# Altium project Fast_Servo.PrjPCB (part 3 of 7)

## Sheet DAC_AFE.SchDoc: DAC AFE
size 420 x 297 mm; Author: P. Zdunek; DrawnBy: P. Zdunek; Organization: WUT ISE; Address1: L3, 12a Rodborough Rd; Address2: Frenchs Forest; Address3: NSW; Address4: Australia 2086; DocumentNumber: 7; SheetNumber: 7; SheetTotal: 37; ModifiedBy: -; CheckedDate: -; Title2: Fast Stabilizer; DivGrp: WUT ISE; Designer: G.Kasprowicz
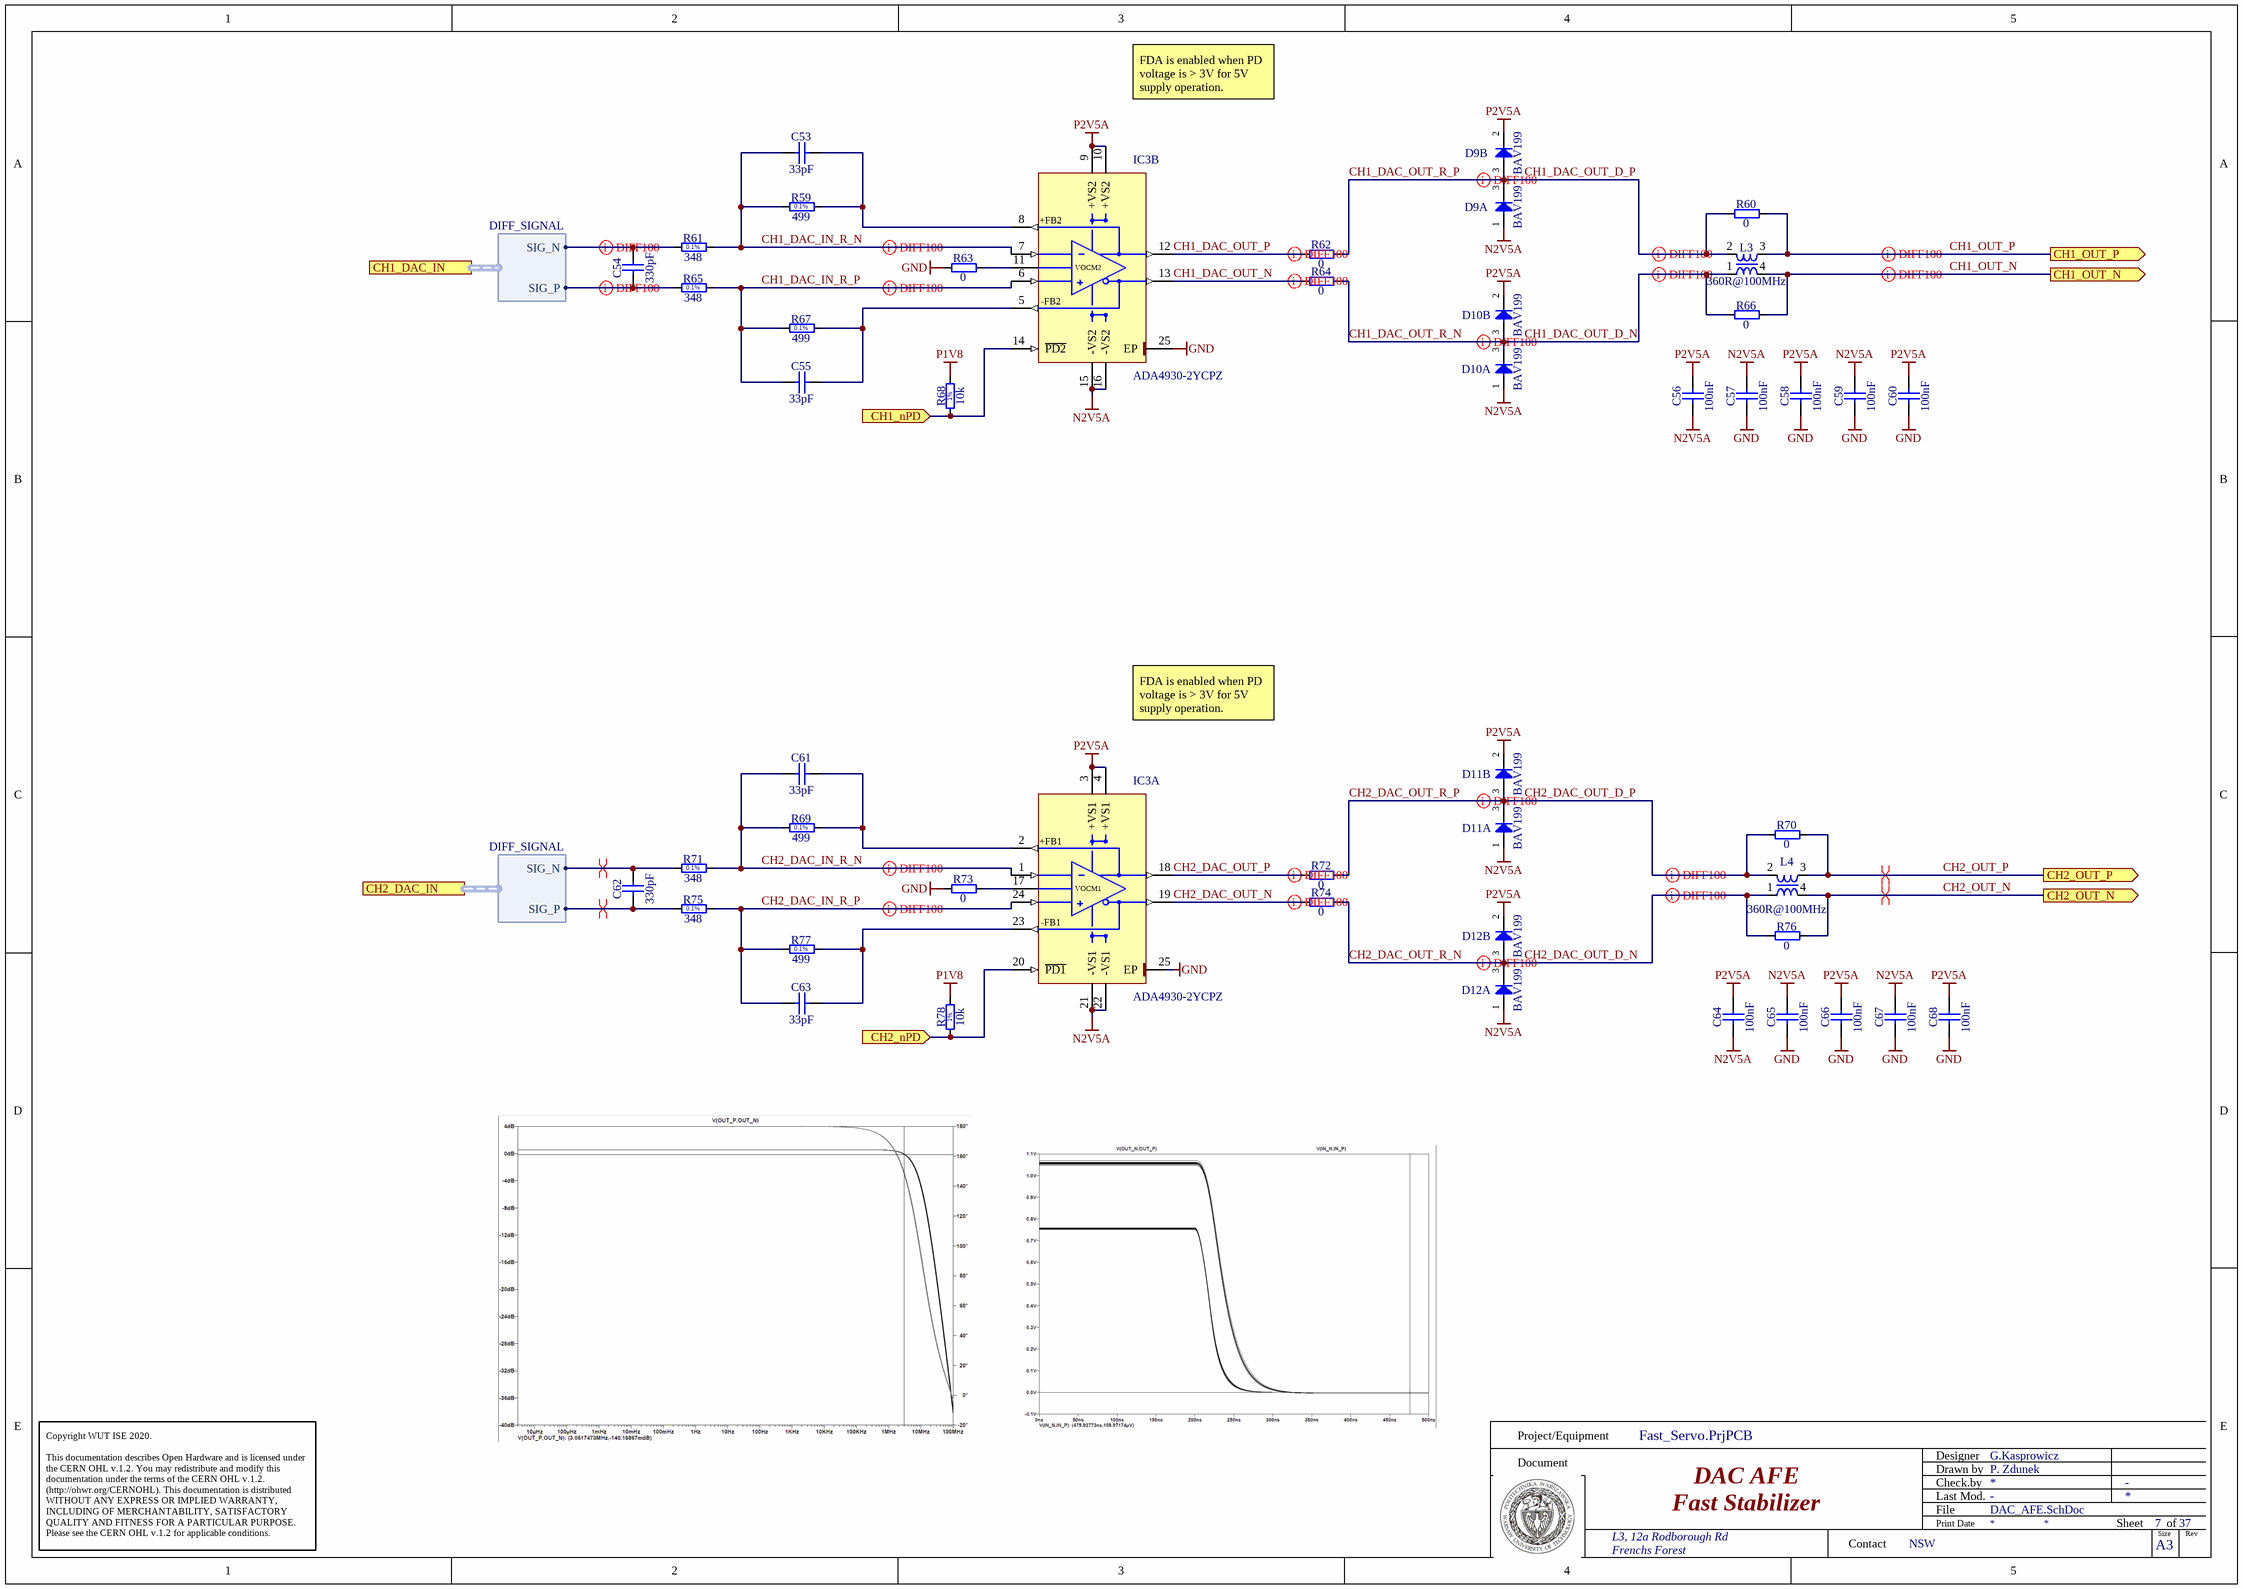
[diagram p8: DAC_AFE.SchDoc]

### Parts
C53  33pF  [CAPC1608X87N]
C54  330pF  [CAPC1608X87N]
C55  33pF  [CAPC1608X87N]
C56  100nF  [CAPC1005X55N]
C57  100nF  [CAPC1005X55N]
C58  100nF  [CAPC1005X55N]
C59  100nF  [CAPC1005X55N]
C60  100nF  [CAPC1005X55N]
C61  33pF  [CAPC1608X87N]
C62  330pF  [CAPC1608X87N]
C63  33pF  [CAPC1608X87N]
C64  100nF  [CAPC1005X55N]
C65  100nF  [CAPC1005X55N]
C66  100nF  [CAPC1005X55N]
C67  100nF  [CAPC1005X55N]
C68  100nF  [CAPC1005X55N]
D9  BAV199  [SOT95P240X110-3N]  (parts A,B of 2)
D10  BAV199  [SOT95P240X110-3N]  (parts A,B of 2)
D11  BAV199  [SOT95P240X110-3N]  (parts A,B of 2)
D12  BAV199  [SOT95P240X110-3N]  (parts A,B of 2)
IC3  ADA4930-2YCPZ  [QFN50P400X400X80-25N-S240]  (parts A,B of 2)
L3  360R@100MHz  [IND_TDK_ACM2012]
L4  360R@100MHz  [IND_TDK_ACM2012]
R59  499  [RESC1608X55N]
R60  0  [RESC1005X40N]
R61  348  [RESC1608X55N]
R62  0  [RESC1005X40N]
R63  0  [RESC1005X40N]
R64  0  [RESC1005X40N]
R65  348  [RESC1608X55N]
R66  0  [RESC1005X40N]
R67  499  [RESC1608X55N]
R68  10k  [RESC1005X40N]
R69  499  [RESC1608X55N]
R70  0  [RESC1005X40N]
R71  348  [RESC1608X55N]
R72  0  [RESC1005X40N]
R73  0  [RESC1005X40N]
R74  0  [RESC1005X40N]
R75  348  [RESC1608X55N]
R76  0  [RESC1005X40N]
R77  499  [RESC1608X55N]
R78  10k  [RESC1005X40N]

### Ports
CH1_DAC_IN (harness DIFF_SIGNAL), CH1_nPD (in), CH1_OUT_N (out), CH1_OUT_P (out), CH2_DAC_IN (harness DIFF_SIGNAL), CH2_nPD (in), CH2_OUT_N (out), CH2_OUT_P (out)

### Harnesses
DIFF_SIGNAL: SIG_N, SIG_P

### Nets
GND: C57.1 C58.1 C59.1 C60.1 C65.1 C66.1 C67.1 C68.1 IC3.25(EP) R63.1 R73.1
N2V5A: C56.1 C57.2 C59.2 C64.1 C65.2 C67.2 D9.1(A) D10.1(A) D11.1(A) D12.1(A) IC3.15(-VS2) IC3.16(-VS2) IC3.21(-VS1) IC3.22(-VS1)
P1V8: R68.2 R78.2
P2V5A: C56.2 C58.2 C60.2 C64.2 C66.2 C68.2 D9.2(C) D10.2(C) D11.2(C) D12.2(C) IC3.3(+VS1) IC3.4(+VS1) IC3.9(+VS2) IC3.10(+VS2)
CH1_DAC_IN_R_N: C53.1 IC3.7(-IN2) R59.1 R61.2
CH1_DAC_IN_R_P: C55.1 IC3.6(+IN2) R65.2 R67.1
CH1_DAC_OUT_D_N: D10.3(COMAC) L3.1 R64.2 R66.1  [also labelled CH1_DAC_OUT_R_N]
CH1_DAC_OUT_D_P: D9.3(COMAC) L3.2 R60.1 R62.2  [also labelled CH1_DAC_OUT_R_P]
CH1_DAC_OUT_N: IC3.13(-OUT2) R64.1
CH1_DAC_OUT_P: IC3.12(+OUT2) R62.1
CH1_OUT_N: L3.4 R66.2 ; port CH1_OUT_N  [project net DAC_0_N]
CH1_OUT_P: L3.3 R60.2 ; port CH1_OUT_P  [project net DAC_0_P]
CH2_DAC_IN_R_N: C61.1 IC3.1(-IN1) R69.1 R71.2
CH2_DAC_IN_R_P: C63.1 IC3.24(+IN1) R75.2 R77.1
CH2_DAC_OUT_D_N: D12.3(COMAC) L4.1 R74.2 R76.1  [also labelled CH2_DAC_OUT_R_N]
CH2_DAC_OUT_D_P: D11.3(COMAC) L4.2 R70.1 R72.2  [also labelled CH2_DAC_OUT_R_P]
CH2_DAC_OUT_N: IC3.19(-OUT1) R74.1
CH2_DAC_OUT_P: IC3.18(+OUT1) R72.1
CH2_OUT_N: L4.4 R76.2 ; port CH2_OUT_N  [project net DAC_1_N]
CH2_OUT_P: L4.3 R70.2 ; port CH2_OUT_P  [project net DAC_1_P]
DAC_AFE_CH1_nPD: IC3.14(~{PD2}) R68.1 ; port CH1_nPD
DAC_AFE_CH2_nPD: IC3.20(~{PD1}) R78.1 ; port CH2_nPD
IOUT_N: C62.2 R71.1 ; port CH2_DAC_IN.SIG_N
IOUT_P: C62.1 R75.1 ; port CH2_DAC_IN.SIG_P
QOUT_N: C54.2 R61.1 ; port CH1_DAC_IN.SIG_N
QOUT_P: C54.1 R65.1 ; port CH1_DAC_IN.SIG_P
NetC53_2: C53.2 IC3.8(+FB2) R59.2
NetC55_2: C55.2 IC3.5(-FB2) R67.2
NetC61_2: C61.2 IC3.2(+FB1) R69.2
NetC63_2: C63.2 IC3.23(-FB1) R77.2
NetIC3_11: IC3.11(VOCM2) R63.2
NetIC3_17: IC3.17(VOCM1) R73.2

### Layout directives
differential pair: CH1_DAC_IN_R_N, CH1_DAC_IN_R_P, CH1_DAC_OUT_D_N, CH1_DAC_OUT_D_P, CH1_DAC_OUT_N, CH1_DAC_OUT_P, CH2_DAC_IN_R_N, CH2_DAC_IN_R_P, CH2_DAC_OUT_D_N, CH2_DAC_OUT_D_P, CH2_DAC_OUT_N, CH2_DAC_OUT_P, DAC_0_N, DAC_0_P, DAC_1_N, DAC_1_P, IOUT_N, IOUT_P, QOUT_N, QOUT_P

### Notes on the sheet
- FDA is enabled when PD voltage is > 3V for 5V supply operation.
- Project/Equipment
- Document
- Designer
- Drawn by
- Check.by
- Copyright WUT ISE 2020.
  This documentation describes Open Hardware and is licensed under the CERN OHL v.1.2. You may redistribute and modify this documentation under the terms of the CERN OHL v.1.2. (http://ohwr.org/CERNOHL). This documentation is distributed WITHOUT ANY EXPRESS OR IMPLIED WARRANTY, INCLUDING OF MERCHANTABILITY, SATISFACTORY QUALITY AND FITNESS FOR A PARTICULAR PURPOSE. Please see the CERN OHL v.1.2 for applicable conditions.
- Contact
- File
- Last Mod.
- Print Date
- Sheet
- Size
- A3
- of
- Rev
- (in symbol R0402_10K_1%_0.0625W_100PPM) 1%
- (in symbol R0603_348R_0.1%_0.063W_10PPM) 0.1%
- (in symbol R0603_499R_0.1%_0.063W_10PPM) 0.1%

### Library data of the parts
C53 C55 C61 C63 = CC0603_33PF_50V_5%_NP0: Non-polarised capacitor; Part Description: SMD Multilayer Chip Ceramic Capacitor; Manufacturer: GENERIC; Manufacturer1 Part Number: 223886715339; Voltage: 50V; TC: C0G/NP0; Tolerance: ±5%; Part Number: CC0603_33PF_50V_5%_NP0; Component Kind: Standard; Component Type: Standard; Pin Count: 2; Value: 33pF; Status: Preferred; Manufacturer Part Number: CC0603_33PF_50V_5%_NP0; Case: 0603; Mounted: Yes; Socket: No; SMD: Yes; Sense: No; Manufacturer1 Example: PHYCOMP; Manufacturer1 ComponentHeight: 0.87mm; HelpURL: \\cern.ch\dfs\Applications\Altium\Datasheets\CC0603_NP0_PHYCOMP.pdf; Author: CERN DEM JLC; CreateDate: 03-Dec-07; LatestRevisionDate: 03-Dec-07
C54 C62 = CC0603_330PF_50V_1%_NP0: Non-polarised capacitor; Part Description: SMD Multilayer Chip Ceramic Capacitor; Manufacturer: GENERIC; Manufacturer1 Part Number: 223886718331; Voltage: 50V; TC: C0G/NP0; Tolerance: ±1%; Part Number: CC0603_330PF_50V_1%_NP0; Component Kind: Standard; Component Type: Standard; Pin Count: 2; Value: 330pF; Status: None; Manufacturer Part Number: CC0603_330PF_50V_1%_NP0; Case: 0603; Mounted: Yes; Socket: No; SMD: Yes; Sense: No; Manufacturer1 Example: PHYCOMP; Manufacturer1 ComponentHeight: 0.87mm; HelpURL: \\cern.ch\dfs\Applications\Altium\Datasheets\CC0603_NP0_PHYCOMP.pdf; Author: CERN DEM MR; CreateDate: 06.09.2017; LatestRevisionDate: 06.09.2017
C56-C60 C64-C68 = CC0402_100NF_16V_10%_X7R: Non-polarised capacitor; Part Description: SMD Multilayer Chip Ceramic Capacitor; Manufacturer: GENERIC; Manufacturer1 Part Number: GRM155R71C104KA88D; Voltage: 16V; TC: X7R; Tolerance: ±10%; Part Number: CC0402_100NF_16V_10%_X7R; Component Kind: Standard; Component Type: Standard; Pin Count: 2; Value: 100nF; Status: Not Recommended; Manufacturer Part Number: CC0402_100NF_16V_10%_X7R; Case: 0402; Mounted: Yes; Socket: No; SMD: Yes; Sense: No; Manufacturer1 Example: MURATA; Manufacturer1 ComponentHeight: 0.55mm; HelpURL: \\cern.ch\dfs\Applications\Altium\Datasheets\CC0402_X7R_MURATA_GRM.pdf; Author: CERN DEM JLC; CreateDate: 05-Dec-13; LatestRevisionDate: 03-Dec-07
D9-D12 = BAV199: Serial Diode; Part Description: Low-Leakage Double Diode; Manufacturer: NXP SEMICONDUCTORS; Voltage: 75V; Power: 250mW; PressFit: No; Bonding: No; Part Number: BAV199; Component Kind: Standard; Component Type: Standard; Device: BAV199; PackageDescription: SOT23 3-Leads, Pitch 0.95mm - Body 1.4x3mm, IPC Medium Density; Manufacturer Part Number: BAV199; Pin Count: 3; Case: SOT23-3; Mounted: Yes; Socket: No; SMD: Yes; Sense: No; ComponentHeight: 1.1mm; HelpURL: \\cern.ch\dfs\Applications\Altium\Datasheets\BAV199.pdf; Author: CERN DEM JMW; CreateDate: 2008-11-21; LatestRevisionDate: 2008-11-21
IC3 = ADA4930-2YCPZ: Ultralow Noise Drivers For Low Voltage ADCs; Manufacturer: ANALOG DEVICES; PressFit: No; Bonding: No; Part Number: ADA4930-2YCPZ; Component Kind: Standard; Component Type: Standard; Device: ADA4930-2YCPZ; PackageDescription: QFN, 0.50mm Pitch, Square; 24 Pin, 4.00mm L X 4.00mm W X 0.80mm H body (w/Thermal Tab 2.40 X 2.40mm), IPC Medium Density; Part Description: Ultralow Noise Drivers For Low Voltage ADCs; Manufacturer Part Number: ADA4930-2YCPZ; Pin Count: 25; Case: QFN24; Mounted: Yes; Socket: No; SMD: Yes; Sense: No; ComponentHeight: 0.8mm; Author: CERN DEM MR; HelpURL: \\cern.ch\dfs\Applications\Altium\Datasheets\ADA4930-2YCPZ.pdf; CreateDate: 23/11/2016; LatestRevisionDate: 23/11/2016
L3 L4 = IND_TDK_ACM2012-361-2P: Inductor Common Mode; Part Description: Common Mode Filters For High-Speed Differential Signal Line, TDK ACM2012 Series; Manufacturer: TDK; Power: 220mA; Resistance: 0R5; Part Number: IND_TDK_ACM2012-361-2P; Component Kind: Standard; Component Type: Standard; Pin Count: 2; Value: 360R@100MHz; Status: None; Manufacturer Part Number: ACM2012-361-2P; Mounted: Yes; Socket: No; SMD: Yes; Sense: No; ComponentHeight: 1.3mm; HelpURL: \\cern.ch\dfs\Applications\Altium\Datasheets\IND_TDK_ACM2012.pdf; Author: CERN DEM BC; CreateDate: 07/07/2020; LatestRevisionDate: 07/07/2020
R59 R67 R69 R77 = R0603_499R_0.1%_0.063W_10PPM: Resistor - 0.1%; Part Description: Thin Film Chip Resistor; Manufacturer: GENERIC; Manufacturer1 Part Number: RN73C1J499RBTDF; Power: 0.063W; TC: ±10ppm; PressFit: No; Part Number: R0603_499R_0.1%_0.063W_10PPM; Component Kind: Standard; Component Type: Standard; Pin Count: 2; Value: 499; Status: Not Recommended; Tolerance: ±0.1%; Manufacturer Part Number: R0603_499R_0.1%_0.063W_10PPM; Case: 0603; Mounted: Yes; Sense: No; Socket: No; SMD: Yes; Manufacturer1 Example: TYCO HOLSWORTHY; Manufacturer1 ComponentHeight: 0.5mm; HelpURL: \\cern.ch\dfs\Applications\Altium\Datasheets\R0603_Tyco_RN73.pdf; Author: CERN DEM JLC; CreateDate: 03-Dec-07; LatestRevisionDate: 13-Mar-08
R60 R62-R64 R66 R70 R72-R74 R76 = R0402_0R_JUMPER: Resistor; Part Description: 1A (0.05R Max DC Resistance) Zero Ohm Jumper; Manufacturer: GENERIC; Manufacturer1 Part Number: 232270591001L; PressFit: No; Part Number: R0402_0R_JUMPER; Component Kind: Standard; Component Type: Standard; Pin Count: 2; Value: 0; Status: Not Recommended; Manufacturer Part Number: R0402_0R_JUMPER; Case: 0402; Mounted: Yes; Sense: No; Socket: No; SMD: Yes; Manufacturer1 Example: YAGEO PHYCOMP; Manufacturer1 ComponentHeight: 0.4mm; HelpURL: \\cern.ch\dfs\Applications\Altium\Datasheets\R0402_Phycomp_RC0402.pdf; Author: CERN DEM JLC
  R60 R66 R70 R76: CreateDate: 03/12/2007; LatestRevisionDate: 17/10/2012
  R62-R64 R72-R74: CreateDate: 03-Dec-07; LatestRevisionDate: 17-Oct-12
R61 R65 R71 R75 = R0603_348R_0.1%_0.063W_10PPM: Resistor - 0.1%; Part Description: Thin Film Chip Resistor; Manufacturer: GENERIC; Manufacturer1 Part Number: RN73C1J348RBTDF; Power: 0.063W; TC: ±10ppm; PressFit: No; Part Number: R0603_348R_0.1%_0.063W_10PPM; Component Kind: Standard; Component Type: Standard; Pin Count: 2; Value: 348; Status: Not Recommended; Tolerance: ±0.1%; Manufacturer Part Number: R0603_348R_0.1%_0.063W_10PPM; Case: 0603; Mounted: Yes; Sense: No; Socket: No; SMD: Yes; Manufacturer1 Example: TYCO HOLSWORTHY; Manufacturer1 ComponentHeight: 0.5mm; HelpURL: \\cern.ch\dfs\Applications\Altium\Datasheets\R0603_Tyco_RN73.pdf; Author: CERN DEM JLC; CreateDate: 03-Dec-07; LatestRevisionDate: 13-Mar-08
R68 R78 = R0402_10K_1%_0.0625W_100PPM: Resistor - 1%; Part Description: General Purpose Thick Film Chip Resistor; Manufacturer: GENERIC; Manufacturer1 Part Number: 232270671003L; PressFit: No; TC: ±100ppm/°C; Part Number: R0402_10K_1%_0.0625W_100PPM; Component Kind: Standard; Component Type: Standard; Pin Count: 2; Value: 10k; Status: Not Recommended; Manufacturer Part Number: R0402_10K_1%_0.0625W_100PPM; Case: 0402; Mounted: Yes; Sense: No; Socket: No; SMD: Yes; Manufacturer1 Example: YAGEO PHYCOMP; Manufacturer1 ComponentHeight: 0.4mm; HelpURL: \\cern.ch\dfs\Applications\Altium\Datasheets\R0402_Phycomp_RC0402.pdf; Author: CERN DEM JLC; CreateDate: 03-Dec-07; LatestRevisionDate: 17-Oct-12; Power: 0.0625W; Tolerance: ±1%

## Sheet DAC.SchDoc: DAC
size 420 x 297 mm; Author: P. Zdunek; DrawnBy: P. Zdunek; Organization: WUT ISE; Address1: PW ISE; Address2: Nowowiejska 15/19 00-665 Warsaw; Address3: p.zdunek90@gmail.com; DocumentNumber: 6; Revision: 1.0; SheetNumber: 6; SheetTotal: 37; ModifiedBy: -; CheckedDate: -; DivGrp: WUT ISE; Designer: P. Zdunek; Title2: Fast Stabilizer; ModifiedDate: -; ProjectName: Sensor Box
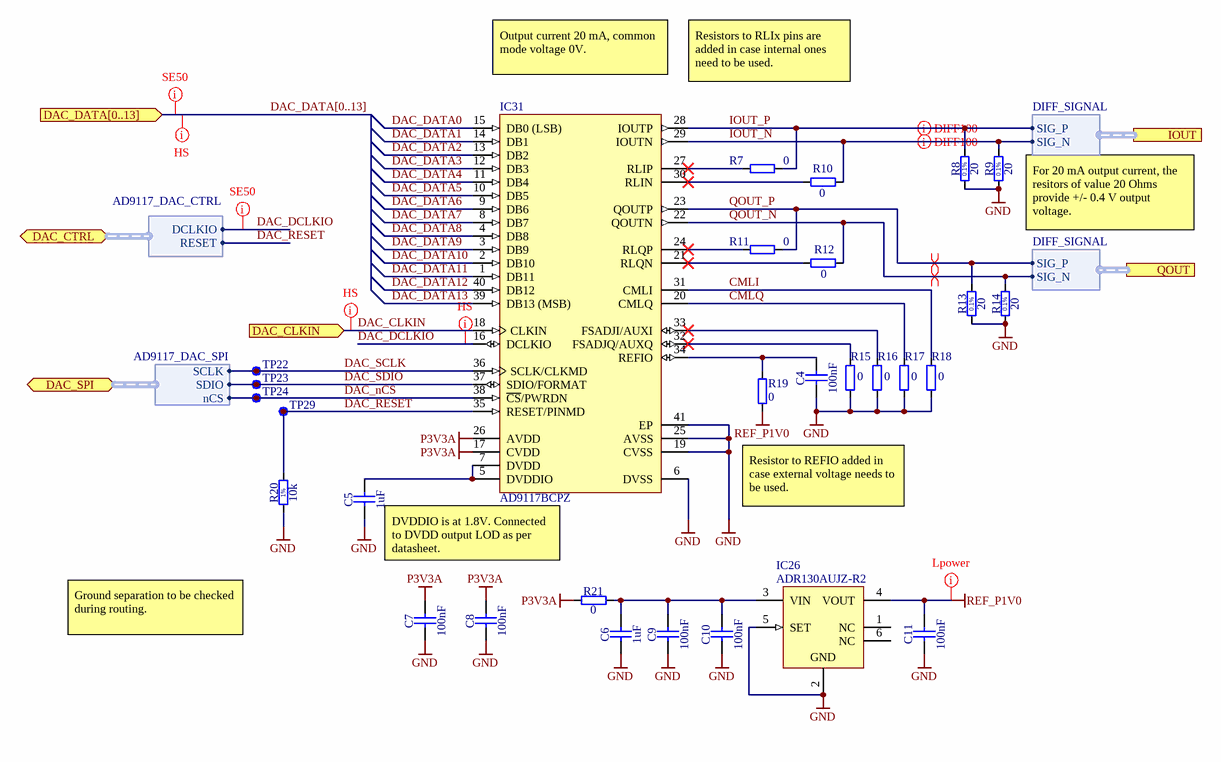
[diagram p9: DAC.SchDoc]

### Parts
C4  100nF  [CAPC1005X55N]
C5  1uF  [CAPC1005X55N]
C6  1uF  [CAPC1005X55N]
C7  100nF  [CAPC1005X55N]
C8  100nF  [CAPC1005X55N]
C9  100nF  [CAPC1005X55N]
C10  100nF  [CAPC1005X55N]
C11  100nF  [CAPC1005X55N]
IC26  ADR130AUJZ-R2  [ADI-UJ-6_N]
IC31  AD9117BCPZ  [CP-40-1_N]
R7  0  [RESC1005X40N]
R8  20  [RESC1608X55N]
R9  20  [RESC1608X55N]
R10  0  [RESC1005X40N]
R11  0  [RESC1005X40N]
R12  0  [RESC1005X40N]
R13  20  [RESC1608X55N]
R14  20  [RESC1608X55N]
R15  0  [RESC1005X40N]
R16  0  [RESC1005X40N]
R17  0  [RESC1005X40N]
R18  0  [RESC1005X40N]
R19  0  [RESC1005X40N]
R20  10k  [RESC1005X40N]
R21  0  [RESC1005X40N]
TP22  SMD Pad  [C100]  (value not drawn)  (no BOM)
TP23  SMD Pad  [C100]  (value not drawn)  (no BOM)
TP24  SMD Pad  [C100]  (value not drawn)  (no BOM)
TP29  SMD Pad  [C100]  (value not drawn)  (no BOM)

### Ports
DAC_CLKIN (in), DAC_CTRL (bidir, harness AD9117_DAC_CTRL), DAC_DATA[0..13] (in), DAC_SPI (bidir, harness AD9117_DAC_SPI), IOUT (harness DIFF_SIGNAL), QOUT (harness DIFF_SIGNAL)

### Harnesses
AD9117_DAC_SPI: SCLK, SDIO, nCS
DIFF_SIGNAL: SIG_P, SIG_N
AD9117_DAC_CTRL: DCLKIO, RESET

### Nets
GND: C4.1 C5.1 C6.1 C7.1 C8.1 C9.1 C10.1 C11.1 IC26.2(GND) IC26.5(SET) IC31.6(DVSS) IC31.19(CVSS) IC31.25(AVSS) IC31.41(EP) R8.1 R9.1 R13.1 R14.1 R15.1 R16.1 R17.2 R18.2 R20.1
P3V3A: C7.2 C8.2 IC31.17(CVDD) IC31.26(AVDD) R21.1
REF_P1V0: C11.2 IC26.4(VOUT) R19.1
CMLI: IC31.31(CMLI) R18.1
CMLQ: IC31.20(CMLQ) R17.1
DAC_CLKIN: IC31.18(CLKIN) ; port DAC_CLKIN
DAC_DATA0: IC31.15(DB0_(LSB))
DAC_DATA1: IC31.14(DB1)
DAC_DATA2: IC31.13(DB2)
DAC_DATA3: IC31.12(DB3)
DAC_DATA4: IC31.11(DB4)
DAC_DATA5: IC31.10(DB5)
DAC_DATA6: IC31.9(DB6)
DAC_DATA7: IC31.8(DB7)
DAC_DATA8: IC31.4(DB8)
DAC_DATA9: IC31.3(DB9)
DAC_DATA10: IC31.2(DB10)
DAC_DATA11: IC31.1(DB11)
DAC_DATA12: IC31.40(DB12)
DAC_DATA13: IC31.39(DB13_(MSB))
DAC_DCLKIO: IC31.16(DCLKIO) ; port DAC_CTRL.DCLKIO
DAC_nCS: IC31.38(~{CS}/PWRDN) TP24.1 ; port DAC_SPI.nCS
DAC_RESET: IC31.35(RESET/PINMD) R20.2 TP29.1 ; port DAC_CTRL.RESET
DAC_SCLK: IC31.36(SCLK/CLKMD) TP22.1 ; port DAC_SPI.SCLK
DAC_SDIO: IC31.37(SDIO/FORMAT) TP23.1 ; port DAC_SPI.SDIO
IOUT_N: IC31.29(IOUTN) R9.2 R10.1 ; port IOUT.SIG_N
IOUT_P: IC31.28(IOUTP) R7.1 R8.2 ; port IOUT.SIG_P
QOUT_N: IC31.22(QOUTN) R12.1 R14.2 ; port QOUT.SIG_N
QOUT_P: IC31.23(QOUTP) R11.1 R13.2 ; port QOUT.SIG_P
NetC4_2: C4.2 IC31.34(REFIO) R19.2
NetC5_2: C5.2 IC31.5(DVDDIO) IC31.7(DVDD)
NetC6_2: C6.2 C9.2 C10.2 IC26.3(VIN) R21.2
NetIC31_21: IC31.21(RLQN) R12.2
NetIC31_24: IC31.24(RLQP) R11.2
NetIC31_27: IC31.27(RLIP) R7.2
NetIC31_30: IC31.30(RLIN) R10.2
NetIC31_32: IC31.32(FSADJQ/AUXQ) R15.2
NetIC31_33: IC31.33(FSADJI/AUXI) R16.2

Not connected (* = marked no-connect by the designer): IC26 1(NC) 6(NC)

### Buses and harness runs
bus DAC_DATA[0..13] = port DAC_DATA[0..13]

### Layout directives
mark named Lpower: REF_P1V0
differential pair: IOUT_P, QOUT_N, QOUT_P
differential pair; differential pair class DIFF100: IOUT_N
net class SE50: (no net found under the mark), DAC_DCLKIO
net class HIGH_SPEED: (no net found under the mark), DAC_CLKIN, DAC_DCLKIO

### Notes on the sheet
- Output current 20 mA, common mode voltage 0V.
- Resistors to RLIx pins are added in case internal ones need to be used.
- (near R9) For 20 mA output current, the resitors of value 20 Ohms provide +/- 0.4 V output voltage.
- Resistor to REFIO added in case external voltage needs to be used.
- DVDDIO is at 1.8V. Connected to DVDD output LOD as per datasheet.
- Ground separation to be checked during routing.
- Project/Equipment
- Document
- Designer
- Drawn by
- Check.by
- Copyright WUT ISE 2020.
  This documentation describes Open Hardware and is licensed under the CERN OHL v.1.2. You may redistribute and modify this documentation under the terms of the CERN OHL v.1.2. (http://ohwr.org/CERNOHL). This documentation is distributed WITHOUT ANY EXPRESS OR IMPLIED WARRANTY, INCLUDING OF MERCHANTABILITY, SATISFACTORY QUALITY AND FITNESS FOR A PARTICULAR PURPOSE. Please see the CERN OHL v.1.2 for applicable conditions.
- Contact
- File
- Last Mod.
- Print Date
- Sheet
- Size
- A3
- of
- Rev
- (in symbol R0402_10K_1%_0.0625W_100PPM) 1%
- (in symbol R0603_20R_0.1%_0.063W_10PPM) 0.1%

### Library data of the parts
C4 = CC0402_100NF_16V_10%_X5R: Non-polarised capacitor; Part Description: SMD Multilayer Chip Ceramic Capacitor; Manufacturer: GENERIC; Manufacturer1 Part Number: GRM155R61C104KA88D; Voltage: 16V; TC: X5R; Tolerance: ±10%; Part Number: CC0402_100NF_16V_10%_X5R; Component Kind: Standard; Component Type: Standard; Pin Count: 2; Value: 100nF; Status: None; Manufacturer Part Number: CC0402_100NF_16V_10%_X5R; Case: 0402; Mounted: Yes; Socket: No; SMD: Yes; Sense: No; Manufacturer1 Example: MURATA; Manufacturer1 ComponentHeight: 0.55mm; HelpURL: \\cern.ch\dfs\Applications\Altium\Datasheets\CC0402_X5R_MURATA_GRM.pdf; Author: CERN DEM JLC; CreateDate: 10/12/2013; LatestRevisionDate: 10/12/2013
C5 C6 = CC0402_1UF_16V_10%_X5R: Non-polarised capacitor; Part Description: SMD Multilayer Chip Ceramic Capacitor; Manufacturer: GENERIC; Manufacturer1 Part Number: C1005X5R1C105KT; Voltage: 16V; TC: X5R; Tolerance: ±10%; Part Number: CC0402_1UF_16V_10%_X5R; Component Kind: Standard; Component Type: Standard; Pin Count: 2; Value: 1uF; Status: Preferred; Manufacturer Part Number: CC0402_1UF_16V_10%_X5R; Case: 0402; Mounted: Yes; Socket: No; SMD: Yes; Sense: No; Manufacturer1 Example: TDK; Manufacturer1 ComponentHeight: 0.55mm; HelpURL: \\cern.ch\dfs\Applications\Altium\Datasheets\CC0402_X5R_TDK_C.pdf; Author: CERN DEM JLC; CreateDate: 25/10/2012; LatestRevisionDate: 25/10/2012
C7-C11 = CC0402_100NF_16V_10%_X7R: as C56 on sheet DAC_AFE; Part Number: CC0402_100NF_16V_10%_X7R; Component Kind: Standard; Component Type: Standard; Pin Count: 2; Value: 100nF; Status: Not Recommended; Manufacturer Part Number: CC0402_100NF_16V_10%_X7R; Case: 0402; Mounted: Yes; Socket: No; SMD: Yes; Sense: No; Manufacturer1 Example: MURATA; Manufacturer1 ComponentHeight: 0.55mm; HelpURL: \\cern.ch\dfs\Applications\Altium\Datasheets\CC0402_X7R_MURATA_GRM.pdf; Author: CERN DEM JLC; CreateDate: 05/12/2013; LatestRevisionDate: 03/12/2007
IC26 = CMP-0784-00536-1: Precision Series Sub-Band Gap Voltage Reference, 1 V Output, 2 to 18 V Supply, Industrial, 6-pin SOT23 (UJ-6), Reel; Manufacturer: Analog Devices; Vout: 0.5V, 1V; Ref Out TC (ppm/C): 15; Min V Supply (V): 2; Max V Supply (V): 18; ComponentLink3Description: Package Specification; ComponentLink4Description: URL Link1; ComponentLink2URL: http://www.analog.com/static/imported-files/data_sheets/ADR130.pdf; ComponentLink3URL: http://www.analog.com/static/imported-files/packages/PKG_PDF/TSOT(UJ)/UJ_6.pdf; Code_JEDEC: MO-193-AA; ComponentLink2Description: Datasheet; ComponentLink1Description: Manufacturer URL; Packing: Reel; Mounting Technology: Surface Mount; PackageReference: UJ-6; PackageVersion: Dec-04; PartNumber: ADR130AUJZ-R2; ComponentLink4URL: Product URL:http://www.analog.com/en/special-linear-functions/voltage-references/adr130/products/product.html; Operating Temp Range: -40 to 125 degC; DatasheetVersion: Rev. B; PackageDescription: 6-Pin Thin Small Outline Transistor Package, Body 2.9 x 1.6 mm, Pitch 0.95 mm; ComponentLink1URL: http://www.analog.com/en/index.html
IC31 = CMP-0318-00565-2: Dual 14-Bit Low Power TxDAC Digital-to-Analog Converter, 0 to +70 degC, CP-40-1, Pb-Free, Tray; Manufacturer: Analog Devices; Generic Part Number: AD9117; Max V+: 3.3V; Single Supply: Yes; # DAC Outputs: 2; Resolution (Bits): 14; ComponentLink4Description: Product URL; ComponentLink2URL: http://www.analog.com/static/imported-files/data_sheets/AD9114_9115_9116_9117.pdf; Packing: Tray; PackageDescription: 40-Pin Lead Frame Chip Scale Package [LFCSP_VQ] Very Thin Quad; PackageVersion: Oct-2006; ComponentLink1URL: http://www.analog.com/en/index.html; Mounting Technology: Surface Mount; ComponentLink5URL: http://www.analog.com/en/digital-to-analog-converters/da-converters/ad9117/products/product.html#prod_cross_sell; ComponentLink3Description: Package Specification; PartNumber: AD9117BCPZ; PackageReference: CP-40-1; ComponentLink1Description: Manufacturer URL; ComponentLink4URL: http://www.analog.com/en/digital-to-analog-converters/da-converters/ad9117/products/product.html; ComponentLink3URL: http://www.analog.com/static/imported-files/packages/PKG_PDF/LFCSP(CP)/CP_40_1.pdf; ComponentLink2Description: Datasheet; ComponentLink5Description: Reference Design URL; Code_JEDEC: MO-220-VJJD-2; RoHS: Y; RevisionNote: Component URL fixed; DatasheetVersion: Rev.B
R7 R10-R12 R15-R19 R21 = R0402_0R_JUMPER: Resistor; Part Description: 1A (0.05R Max DC Resistance) Zero Ohm Jumper; Manufacturer: GENERIC; Manufacturer1 Part Number: 232270591001L; Part Number: R0402_0R_JUMPER; Component Kind: Standard; Component Type: Standard; Pin Count: 2; Value: 0; Status: Not recommended; Manufacturer Part Number: R0402_0R_JUMPER; Case: 0402; Mounted: Yes; Sense: No; Socket: No; SMD: Yes; Manufacturer1 Example: YAGEO PHYCOMP; Manufacturer1 ComponentHeight: 0.4mm; HelpURL: \\cern.ch\dfs\Applications\Altium\Datasheets\R0402_Phycomp_RC0402.pdf; Author: CERN DEM JLC; CreateDate: 03.12.2007; LatestRevisionDate: 17.10.2012
R8 R9 R13 R14 = R0603_20R_0.1%_0.063W_10PPM: Resistor - 0.1%; Part Description: Thin Film Chip Resistor; Manufacturer: GENERIC; Manufacturer1 Part Number: RN73C1J20RBTDF; PressFit: No; Power: 0.063W; TC: ±10ppm; Part Number: R0603_20R_0.1%_0.063W_10PPM; Component Kind: Standard; Component Type: Standard; Pin Count: 2; Value: 20; Status: Not Recommended; Manufacturer Part Number: R0603_20R_0.1%_0.063W_10PPM; Case: 0603; Mounted: Yes; Sense: No; Socket: No; SMD: Yes; Manufacturer1 Example: TYCO HOLSWORTHY; Manufacturer1 ComponentHeight: 0.5mm; HelpURL: \\cern.ch\dfs\Applications\Altium\Datasheets\R0603_Tyco_RN73.pdf; Author: CERN DEM JLC; CreateDate: 03-Dec-07; LatestRevisionDate: 13-Mar-08; Tolerance: ±0.1%
R20 = R0402_10K_1%_0.0625W_100PPM: Resistor - 1%; Part Description: General Purpose Thick Film Chip Resistor; Manufacturer: GENERIC; Manufacturer1 Part Number: 232270671003L; TC: ±100ppm/°C; PressFit: No; Part Number: R0402_10K_1%_0.0625W_100PPM; Component Kind: Standard; Component Type: Standard; Pin Count: 2; Value: 10k; Status: Not Recommended; Manufacturer Part Number: R0402_10K_1%_0.0625W_100PPM; Case: 0402; Mounted: Yes; Sense: No; Socket: No; SMD: Yes; Manufacturer1 Example: YAGEO PHYCOMP; Manufacturer1 ComponentHeight: 0.4mm; HelpURL: \\cern.ch\dfs\Applications\Altium\Datasheets\R0402_Phycomp_RC0402.pdf; Author: CERN DEM JLC; CreateDate: 03-Dec-07; LatestRevisionDate: 17-Oct-12; Power: 0.0625W; Tolerance: ±1%
TP22-TP24 TP29 = SMD_PAD_D1MM: Through Hole Pad; Part Description: 1mm Diameter SMD Pad; Mounted: No; Part Number: SMD_PAD_D1MM; Component Type: Standard (No BOM); Pin Count: 1; Family: SMD Pad; Socket: No; SMD: Yes; Sense: No; Status: None; ComponentHeight: 0mm; HelpURL: Undefined; Author: CERN DEM JLC; CreateDate: 10/10/2017; LatestRevisionDate: 10/10/2017; PackageDescription: 1mm Diameter SMD Pad

## Sheet CON_MEZZANINE_GPIO.SchDoc: Mezzanine con GPIO
size 420 x 297 mm; Author: P. Zdunek; DrawnBy: P. Zdunek; Organization: Altium Limited; Address1: L3, 12a Rodborough Rd; Address2: Frenchs Forest; Address3: NSW; Address4: Australia 2086; DocumentNumber: 23; SheetNumber: 23; SheetTotal: 37; ModifiedBy: -; CheckedDate: -; Title2: Fast Stabilizer; DivGrp: WUT ISE; Designer: G.Kasprowicz
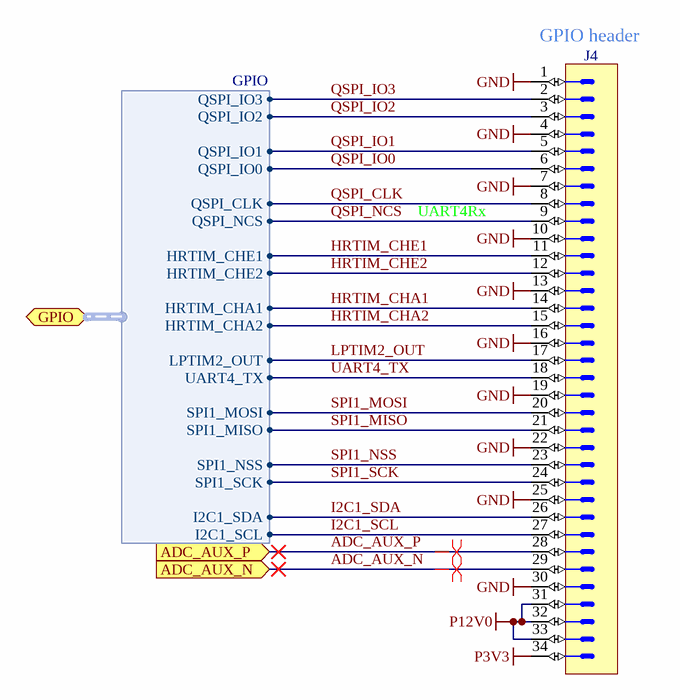
[diagram p10: CON_MEZZANINE_GPIO.SchDoc]

### Parts
J4  Header 34  [3M_N2534-6002RB]  (value not drawn)

### Ports
ADC_AUX_N (in), ADC_AUX_P (in), GPIO (bidir, harness GPIO)

### Harnesses
GPIO: QSPI_IO3, QSPI_IO2, QSPI_IO1, QSPI_IO0, QSPI_CLK, QSPI_NCS, HRTIM_CHE1, HRTIM_CHE2, HRTIM_CHA1, HRTIM_CHA2, LPTIM2_OUT, UART4_TX, SPI1_MOSI, SPI1_MISO, SPI1_NSS, SPI1_SCK, I2C1_SDA, I2C1_SCL

### Nets
GND: J4.1 J4.4 J4.7 J4.10 J4.13 J4.16 J4.19 J4.22 J4.25 J4.30
P3V3: J4.34
P12V0: J4.31 J4.32 J4.33
ADC_AUX_N: J4.29 ; port ADC_AUX_N
ADC_AUX_P: J4.28 ; port ADC_AUX_P
HRTIM_CHA1: J4.14 ; port GPIO.HRTIM_CHA1
HRTIM_CHA2: J4.15 ; port GPIO.HRTIM_CHA2
HRTIM_CHE1: J4.11 ; port GPIO.HRTIM_CHE1
HRTIM_CHE2: J4.12 ; port GPIO.HRTIM_CHE2
I2C1_SCL: J4.27 ; port GPIO.I2C1_SCL
I2C1_SDA: J4.26 ; port GPIO.I2C1_SDA
LPTIM2_OUT: J4.17 ; port GPIO.LPTIM2_OUT
QSPI_CLK: J4.8 ; port GPIO.QSPI_CLK
QSPI_IO0: J4.6 ; port GPIO.QSPI_IO0
QSPI_IO1: J4.5 ; port GPIO.QSPI_IO1
QSPI_IO2: J4.3 ; port GPIO.QSPI_IO2
QSPI_IO3: J4.2 ; port GPIO.QSPI_IO3
QSPI_NCS: J4.9 ; port GPIO.QSPI_NCS
SPI1_MISO: J4.21 ; port GPIO.SPI1_MISO
SPI1_MOSI: J4.20 ; port GPIO.SPI1_MOSI
SPI1_NSS: J4.23 ; port GPIO.SPI1_NSS
SPI1_SCK: J4.24 ; port GPIO.SPI1_SCK
UART4_TX: J4.18 ; port GPIO.UART4_TX

### Layout directives
differential pair: ADC_AUX_N, ADC_AUX_P

### Notes on the sheet
- (near J4) GPIO header
- UART4Rx
- Project/Equipment
- Document
- Designer
- Drawn by
- Check.by
- Copyright WUT ISE 2020.
  This documentation describes Open Hardware and is licensed under the CERN OHL v.1.2. You may redistribute and modify this documentation under the terms of the CERN OHL v.1.2. (http://ohwr.org/CERNOHL). This documentation is distributed WITHOUT ANY EXPRESS OR IMPLIED WARRANTY, INCLUDING OF MERCHANTABILITY, SATISFACTORY QUALITY AND FITNESS FOR A PARTICULAR PURPOSE. Please see the CERN OHL v.1.2 for applicable conditions.
- Contact
- File
- Last Mod.
- Print Date
- Sheet
- Size
- A3
- of
- Rev

### Library data of the parts
J4 = 3M_N2534-6002RB: Connector 34 Male; Part Description: 34 Contacts - Straight .100'' x .100'' Low Profile Four-Wall Header, 2500 Series; Manufacturer: 3M; PressFit: No; Part Number: 3M_N2534-6002RB; Component Kind: Standard; Component Type: Standard; Pin Count: 34; Family: Header 34; Mounted: Yes; Socket: No; SMD: No; Sense: No; Status: None; Manufacturer Part Number: N2534-6002RB; ComponentHeight: 10.03mm; HelpURL: \\cern.ch\dfs\Applications\Altium\Datasheets\3M_N2534-6002RB.pdf; Author: CERN DEM JLC; CreateDate: 11.02.2009; LatestRevisionDate: 11.08.2009

## Sheet CON_EEM.SchDoc: EEM connector & drivers
size 420 x 297 mm; Author: G.Kasprowicz; CompanyName: WUT ISE; DrawnBy: G.Kasprowicz; Organization: WUT ISE; Address1: PW ISE; Address2: Nowowiejska 15/19 00-665 Warsaw; Address3: gkasprow@gmail.com; DocumentNumber: 19; Revision: 1.0; SheetNumber: 19; SheetTotal: 37; ModifiedBy: -; CheckedDate: -; DivGrp: WUT ISE; Designer: G.Kasprowicz; Title2: Title 2; ModifiedDate: -; ProjectName: Sensor Box
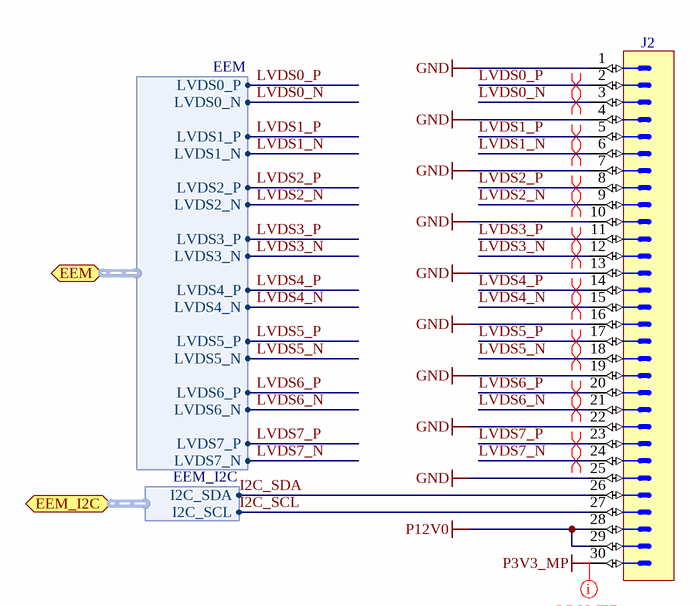
[diagram p11: CON_EEM.SchDoc]

### Parts
J2  (no value)  [3M_N2530-6002RB]

### Ports
EEM (bidir, harness EEM), EEM_I2C (bidir, harness EEM_I2C)

### Harnesses
EEM: LVDS0_P, LVDS0_N, LVDS1_P, LVDS1_N, LVDS2_P, LVDS2_N, LVDS3_P, LVDS3_N, LVDS4_P, LVDS4_N, LVDS5_P, LVDS5_N, LVDS6_P, LVDS6_N, LVDS7_P, LVDS7_N
EEM_I2C: I2C_SDA, I2C_SCL

### Nets
GND: J2.1 J2.4 J2.7 J2.10 J2.13 J2.16 J2.19 J2.22 J2.25
P3V3_MP: J2.30
P12V0: J2.28 J2.29
I2C_SCL: J2.27 ; port EEM_I2C.I2C_SCL
I2C_SDA: J2.26 ; port EEM_I2C.I2C_SDA
LVDS0_N: J2.3 ; port EEM.LVDS0_N
LVDS0_P: J2.2 ; port EEM.LVDS0_P
LVDS1_N: J2.6 ; port EEM.LVDS1_N
LVDS1_P: J2.5 ; port EEM.LVDS1_P
LVDS2_N: J2.9 ; port EEM.LVDS2_N
LVDS2_P: J2.8 ; port EEM.LVDS2_P
LVDS3_N: J2.12 ; port EEM.LVDS3_N
LVDS3_P: J2.11 ; port EEM.LVDS3_P
LVDS4_N: J2.15 ; port EEM.LVDS4_N
LVDS4_P: J2.14 ; port EEM.LVDS4_P
LVDS5_N: J2.18 ; port EEM.LVDS5_N
LVDS5_P: J2.17 ; port EEM.LVDS5_P
LVDS6_N: J2.21 ; port EEM.LVDS6_N
LVDS6_P: J2.20 ; port EEM.LVDS6_P
LVDS7_N: J2.24 ; port EEM.LVDS7_N
LVDS7_P: J2.23 ; port EEM.LVDS7_P

### Layout directives
differential pair: LVDS0_N, LVDS0_P, LVDS1_N, LVDS1_P, LVDS2_N, LVDS2_P, LVDS3_N, LVDS3_P, LVDS4_N, LVDS4_P, LVDS5_N, LVDS5_P, LVDS6_N, LVDS6_P, LVDS7_N, LVDS7_P
net class Lpower: P3V3_MP

### Notes on the sheet
- Project/Equipment
- Document
- Designer
- Drawn by
- Check.by
- Copyright WUT ISE 2020.
  This documentation describes Open Hardware and is licensed under the CERN OHL v.1.2. You may redistribute and modify this documentation under the terms of the CERN OHL v.1.2. (http://ohwr.org/CERNOHL). This documentation is distributed WITHOUT ANY EXPRESS OR IMPLIED WARRANTY, INCLUDING OF MERCHANTABILITY, SATISFACTORY QUALITY AND FITNESS FOR A PARTICULAR PURPOSE. Please see the CERN OHL v.1.2 for applicable conditions.
- Contact
- File
- Last Mod.
- Print Date
- Sheet
- Size
- A3
- of
- Rev

### Library data of the parts
J2 = 3M_N2530-6002RB: Connector 30 Male; Part Description: 30 Contacts - Straight .100'' x .100'' Low Profile Four-Wall Header, 2500 Series; Manufacturer: 3M; PressFit: No; Part Number: 3M_N2530-6002RB; Component Kind: Standard; Component Type: Standard; Pin Count: 30; Family: Header 30; Mounted: Yes; Socket: No; SMD: No; Sense: No; Status: None; Manufacturer Part Number: N2530-6002RB; ComponentHeight: 10.03mm; HelpURL: \\cern.ch\dfs\Applications\Altium\Datasheets\3M_N2530-6002RB.pdf; Author: CERN DEM JLC; CreateDate: 11.02.2009; LatestRevisionDate: 11.08.2009

## Sheet EEPROM_Sensors.SchDoc: EEPROM
size 420 x 297 mm; Author: P. Zdunek; DrawnBy: P. Zdunek; Organization: Altium Limited; Address1: L3, 12a Rodborough Rd; Address2: Frenchs Forest; Address3: NSW; Address4: Australia 2086; DocumentNumber: 16; SheetNumber: 16; SheetTotal: 37; ModifiedBy: -; CheckedDate: -; Title2: Fast Stabilizer; DivGrp: WUT ISE; Designer: G.Kasprowicz
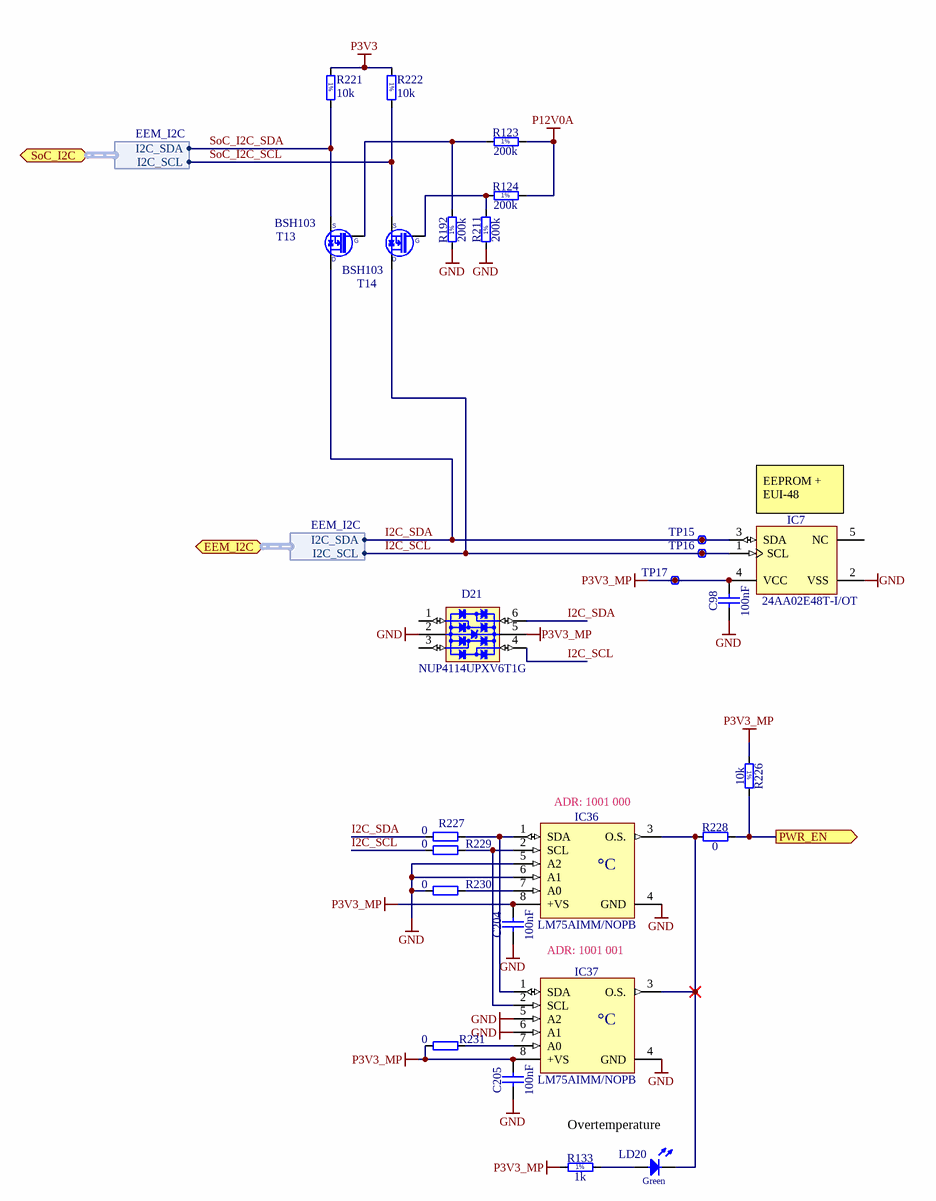
[diagram p12: EEPROM_Sensors.SchDoc]

### Parts
C98  100nF  [CAPC1005X55N]
C204  100nF  [CAPC1005X55N]
C205  100nF  [CAPC1005X55N]
D21  NUP4114UPXV6T1G  [SOTFL50P160X60-6N]
IC7  24AA02E48T-I/OT  [SOT95P280X145-5N]
IC36  LM75AIMM/NOPB  [SOP65P490X109-8N]
IC37  LM75AIMM/NOPB  [SOP65P490X109-8N]
LD20  Green  [LED_KINGBRIGHT_KPH-1608CGCK]
R123  200k  [RESC1005X40N]
R124  200k  [RESC1005X40N]
R133  1k  [RESC1005X40N]
R192  200k  [RESC1005X40N]
R211  200k  [RESC1005X40N]
R221  10k  [RESC1005X40N]
R222  10k  [RESC1005X40N]
R226  10k  [RESC1005X40N]
R227  0  [RESC1005X40N]
R228  0  [RESC1005X40N]
R229  0  [RESC1005X40N]
R230  0  [RESC1005X40N]
R231  0  [RESC1005X40N]
T13  BSH103  [SOT95P230X110-3N]
T14  BSH103  [SOT95P230X110-3N]
TP15  Test Point  [TPS127]  (value not drawn)  (no BOM)
TP16  Test Point  [TPS127]  (value not drawn)  (no BOM)
TP17  Test Point  [TPS127]  (value not drawn)  (no BOM)

### Ports
EEM_I2C (bidir, harness EEM_I2C), PWR_EN (out), SoC_I2C (bidir, harness EEM_I2C)

### Harnesses
EEM_I2C: I2C_SCL, I2C_SDA

### Nets
GND: C98.1 C204.1 C205.1 D21.2(GND) IC7.2(VSS) IC36.4(GND) IC36.5(A2) IC36.6(A1) IC37.4(GND) IC37.5(A2) IC37.6(A1) R192.1 R211.1 R230.1
P3V3: R221.1 R222.1
P3V3_MP: C98.2 C204.2 C205.2 D21.5(VBUS) IC7.4(VCC) IC36.8(+VS) IC37.8(+VS) R133.1 R226.1 R231.1 TP17.1
P12V0A: R123.2 R124.2
I2C_SCL: D21.4(I/O3) IC7.1(SCL) R229.1 T14.3(D) TP16.1 ; port EEM_I2C.I2C_SCL
I2C_SDA: D21.6(I/O4) IC7.3(SDA) R227.1 T13.3(D) TP15.1 ; port EEM_I2C.I2C_SDA
PWR_EN: R226.2 R228.2 ; port PWR_EN
SoC_I2C_SCL: R222.2 T14.2(S) ; port SoC_I2C.I2C_SCL
SoC_I2C_SDA: R221.2 T13.2(S) ; port SoC_I2C.I2C_SDA
NetIC36_1: IC36.1(SDA) IC37.1(SDA) R227.2
NetIC36_2: IC36.2(SCL) IC37.2(SCL) R229.2
NetIC36_3: IC36.3(O.S.) IC37.3(O.S.) LD20.1(C) R228.1
NetIC36_7: IC36.7(A0) R230.2
NetIC37_7: IC37.7(A0) R231.2
NetLD20_2: LD20.2(A) R133.2
NetR123_1: R123.1 R192.2 T13.1(G)
NetR124_1: R124.1 R211.2 T14.1(G)

Not connected (* = marked no-connect by the designer): D21 1(I/O1) 3(I/O2); IC7 5(NC)

### Notes on the sheet
- (near IC7) EEPROM + EUI-48
- (near IC36) ADR: 1001 000
- ADR: 1001 001
- Overtemperature
- Project/Equipment
- Document
- Designer
- Drawn by
- Check.by
- Copyright WUT ISE 2020.
  This documentation describes Open Hardware and is licensed under the CERN OHL v.1.2. You may redistribute and modify this documentation under the terms of the CERN OHL v.1.2. (http://ohwr.org/CERNOHL). This documentation is distributed WITHOUT ANY EXPRESS OR IMPLIED WARRANTY, INCLUDING OF MERCHANTABILITY, SATISFACTORY QUALITY AND FITNESS FOR A PARTICULAR PURPOSE. Please see the CERN OHL v.1.2 for applicable conditions.
- Contact
- File
- Last Mod.
- Print Date
- Sheet
- Size
- A3
- of
- Rev
- (in symbol LM75AIMM/NOPB) °C
- (in symbol R0402_1K_1%_0.0625W_100PPM) 1%
- (in symbol R0402_10K_1%_0.0625W_100PPM) 1%
- (in symbol R0402_200K_1%_0.0625W_100PPM) 1%

### Library data of the parts
C98 C204 C205 = CC0402_100NF_16V_10%_X5R: as C4 on sheet DAC; Part Number: CC0402_100NF_16V_10%_X5R; Component Kind: Standard; Component Type: Standard; Pin Count: 2; Value: 100nF; Status: None; Manufacturer Part Number: CC0402_100NF_16V_10%_X5R; Case: 0402; Mounted: Yes; Socket: No; SMD: Yes; Sense: No; Manufacturer1 Example: MURATA; Manufacturer1 ComponentHeight: 0.55mm; HelpURL: \\cern.ch\dfs\Applications\Altium\Datasheets\CC0402_X5R_MURATA_GRM.pdf; Author: CERN DEM JLC; CreateDate: 10.12.2013; LatestRevisionDate: 10.12.2013
D21 = NUP4114UPXV6T1G: Part Description: ESD Protection Diodes Array (8kV) with Low Clamping Voltage; Manufacturer: ON SEMICONDUCTOR; Voltage: 5.5V; PressFit: No; Bonding: No; Part Number: NUP4114UPXV6T1G; Component Kind: Standard; Component Type: Standard; Device: NUP4114UPXV6T1G; PackageDescription: SOTFL (SOT666, SOT563,), 0.50mm, Pitch; 6 Pin, 1.20mm W X 1.60mm L X 0.60mm H Body, IPC Medium Density; Manufacturer Part Number: NUP4114UPXV6T1G; Pin Count: 8; Mounted: Yes; Socket: No; SMD: Yes; Sense: No; ComponentHeight: 1.75mm; HelpURL: \\cern.ch\dfs\Applications\Altium\Datasheets\NUP4114UPXV6T1G.pdf; Author: CERN DEM JLC; CreateDate: 05.12.2012; LatestRevisionDate: 05.12.2012
IC7 = 24AA02E48T-I/OT: 1.7V-5.5V, 2K I2C Serial EEPROM With EUI-48 Node Identity; Manufacturer: MICROCHIP TECHNOLOGY; PressFit: No; Bonding: No; Part Number: 24AA02E48T-I/OT; Component Kind: Standard; Component Type: Standard; Device: 24AA02E48T-I/OT; PackageDescription: SOT, 0.95mm pitch; 5 pin, 1.60mm W X 2.90mm L X 1.45mm H body, IPC Medium Density; Part Description: 1.7V-5.5V, 2K I2C Serial EEPROM With EUI-48 Node Identity; Manufacturer Part Number: 24AA02E48T-I/OT; Pin Count: 5; Case: SOT23-5; Mounted: Yes; Socket: No; SMD: Yes; Sense: No; ComponentHeight: 1.45mm; HelpURL: \\cern.ch\dfs\Applications\Altium\Datasheets\24AA02E48T-I-OT.pdf; Author: CERN DEM MR; CreateDate: 31.03.2016; LatestRevisionDate: 31.03.2016
IC36 IC37 = LM75AIMM/NOPB: Digital Temperature Sensor and Thermal Watchdog with Two-Wire Interface; Part Description: -25° to +100°C ±2°C Digital Temperature Sensor and Thermal Watchdog with Two-Wire Interface; Manufacturer: TEXAS INSTRUMENTS; PressFit: No; Bonding: No; Part Number: LM75AIMM/NOPB; Component Kind: Standard; Component Type: Standard; Device: LM75AIMM/NOPB; PackageDescription: SOP, 0.65mm pitch; 8 pin,3.00mm W X 3.00mm L X 1.09mm H bodyI, PC Medium Density; Manufacturer Part Number: LM75AIMM/NOPB; Pin Count: 8; Case: SSOP8; Mounted: Yes; Socket: No; SMD: Yes; Sense: No; ComponentHeight: 1.09mm; HelpURL: \\cern.ch\dfs\Applications\Altium\Datasheets\LM75AIMM-NOPB.pdf; Author: CERN DEM JLC; CreateDate: 15.10.2012; LatestRevisionDate: 15.10.2012
LD20 = LED_KINGBRIGHT_KPH-1608CGCK: LED Green 1C 2A; Part Description: SMD Green LED, Case 1.6mmX0.8mm(0603), 0.65mm Thickness; PressFit: No; Bonding: No; Part Number: LED_KINGBRIGHT_KPH-1608CGCK; Component Kind: Standard; Component Type: Standard; Color: Green; PackageDescription: SMT Green LED, Case 0603, Body L 1.6 x W 0.8mm H 0.65mm; Manufacturer: KINGBRIGHT; Manufacturer Part Number: KPH-1608CGCK; Pin Count: 2; Mounted: Yes; Socket: No; SMD: Yes; Sense: No; ComponentHeight: 0.65mm; HelpURL: \\cern.ch\dfs\Applications\Altium\Datasheets\LED_KINGBRIGHT_KPH-1608CGCK.pdf; Author: CERN DEM JLC; CreateDate: 03/07/2017; LatestRevisionDate: 03/07/2017
R123 R124 R192 R211 = R0402_200K_1%_0.0625W_100PPM: Resistor - 1%; Part Description: General Purpose Thick Film Chip Resistor; Manufacturer: GENERIC; Manufacturer1 Part Number: 232270672004L; TC: ±100ppm/°C; PressFit: No; Part Number: R0402_200K_1%_0.0625W_100PPM; Component Kind: Standard; Component Type: Standard; Pin Count: 2; Value: 200k; Status: Not Recommended; Power: 0.0625W; Tolerance: ±1%; Manufacturer Part Number: R0402_200K_1%_0.0625W_100PPM; Case: 0402; Mounted: Yes; Sense: No; Socket: No; SMD: Yes; Manufacturer1 Example: YAGEO PHYCOMP; Manufacturer1 ComponentHeight: 0.4mm; HelpURL: \\cern.ch\dfs\Applications\Altium\Datasheets\R0402_Phycomp_RC0402.pdf; Author: CERN DEM JLC; CreateDate: 03/12/2007; LatestRevisionDate: 17/10/2012
R133 = R0402_1K_1%_0.0625W_100PPM: Resistor - 1%; Part Description: General Purpose Thick Film Chip Resistor; Manufacturer: GENERIC; Manufacturer1 Part Number: 232270671002L; TC: ±100ppm/°C; PressFit: No; Part Number: R0402_1K_1%_0.0625W_100PPM; Component Kind: Standard; Component Type: Standard; Pin Count: 2; Value: 1k; Status: Not Recommended; Power: 0.0625W; Tolerance: ±1%; Manufacturer Part Number: R0402_1K_1%_0.0625W_100PPM; Case: 0402; Mounted: Yes; Sense: No; Socket: No; SMD: Yes; Manufacturer1 Example: YAGEO PHYCOMP; Manufacturer1 ComponentHeight: 0.4mm; HelpURL: \\cern.ch\dfs\Applications\Altium\Datasheets\R0402_Phycomp_RC0402.pdf; Author: CERN DEM JLC; CreateDate: 03.12.2007; LatestRevisionDate: 17.10.2012
R221 R222 = R0402_10K_1%_0.0625W_100PPM: Resistor - 1%; Part Description: General Purpose Thick Film Chip Resistor; Manufacturer: GENERIC; Manufacturer1 Part Number: 232270671003L; TC: ±100ppm/°C; Part Number: R0402_10K_1%_0.0625W_100PPM; Component Kind: Standard; Component Type: Standard; Pin Count: 2; Value: 10k; Status: Not recommended; Power: 0.0625W; Tolerance: ±1%; Manufacturer Part Number: R0402_10K_1%_0.0625W_100PPM; Case: 0402; Mounted: Yes; Sense: No; Socket: No; SMD: Yes; Manufacturer1 Example: YAGEO PHYCOMP; Manufacturer1 ComponentHeight: 0.4mm; HelpURL: \\cern.ch\dfs\Applications\Altium\Datasheets\R0402_Phycomp_RC0402.pdf; Author: CERN DEM JLC; CreateDate: 03.12.2007; LatestRevisionDate: 17.10.2012
R226 = R0402_10K_1%_0.0625W_100PPM: as R20 on sheet DAC; Part Number: R0402_10K_1%_0.0625W_100PPM; Component Kind: Standard; Component Type: Standard; Pin Count: 2; Value: 10k; Status: Not Recommended; Power: 0.0625W; Tolerance: ±1%; Manufacturer Part Number: R0402_10K_1%_0.0625W_100PPM; Case: 0402; Mounted: Yes; Sense: No; Socket: No; SMD: Yes; Manufacturer1 Example: YAGEO PHYCOMP; Manufacturer1 ComponentHeight: 0.4mm; HelpURL: \\cern.ch\dfs\Applications\Altium\Datasheets\R0402_Phycomp_RC0402.pdf; Author: CERN DEM JLC; CreateDate: 03.12.2007; LatestRevisionDate: 17.10.2012
R227-R231 = R0402_0R_JUMPER: as R7 on sheet DAC; Part Number: R0402_0R_JUMPER; Component Kind: Standard; Component Type: Standard; Pin Count: 2; Value: 0; Status: Not recommended; Manufacturer Part Number: R0402_0R_JUMPER; Case: 0402; Mounted: Yes; Sense: No; Socket: No; SMD: Yes; Manufacturer1 Example: YAGEO PHYCOMP; Manufacturer1 ComponentHeight: 0.4mm; HelpURL: \\cern.ch\dfs\Applications\Altium\Datasheets\R0402_Phycomp_RC0402.pdf; Author: CERN DEM JLC; CreateDate: 03.12.2007; LatestRevisionDate: 17.10.2012
T13 T14 = BSH103: N-CHANNEL MOSFET WITH DIODE; Part Description: 30V 850mA N-Channel Enhancement Mode Field-Effect Transistor; Manufacturer: NEXPERIA; PressFit: No; Bonding: No; Part Number: BSH103; Component Kind: Standard; Component Type: Standard; Device: BSH103; PackageDescription: SOT23, 3 pin, Pitch 0.95mm - 1.3mm W X 2.9mm L X 1.1mm H, IPC Medium Density; Manufacturer Part Number: BSH103; Pin Count: 3; Case: SOT23-3; Mounted: Yes; Socket: No; SMD: Yes; Sense: No; ComponentHeight: 1.1mm; HelpURL: \\cern.ch\dfs\Applications\Altium\Datasheets\BSH103.pdf; Author: CERN DEM JLC; CreateDate: 16.03.2010; LatestRevisionDate: 20.06.2017; ClassName: Artix
TP15-TP17 = SMD_PAD_1.27X1.27MM: Part Description: 1.27mm x 1.27mm PCB Copper Area (SMD Test Point); Mounted: No; Part Number: SMD_PAD_1.27X1.27MM; Component Type: Standard (No BOM); Pin Count: 1; Family: Test Point; Socket: No; SMD: Yes; Sense: No; Status: None; ComponentHeight: 0mm; HelpURL: Undefined; Author: CERN DEM JLC; CreateDate: 12.01.2008; LatestRevisionDate: 12.01.2008; PackageDescription: 1.27mm x 1.27mm PCB Copper Area (SMD Test Point)

## Sheet DAC_AUX.SchDoc: Auxillary DAC
size 420 x 297 mm; Author: P. Zdunek; DrawnBy: P. Zdunek; Organization: Altium Limited; Address1: L3, 12a Rodborough Rd; Address2: Frenchs Forest; Address3: NSW; Address4: Australia 2086; DocumentNumber: 11; SheetNumber: 11; SheetTotal: 37; ModifiedBy: -; CheckedDate: -; Title2: Fast Stabilizer; DivGrp: WUT ISE; Designer: G.Kasprowicz
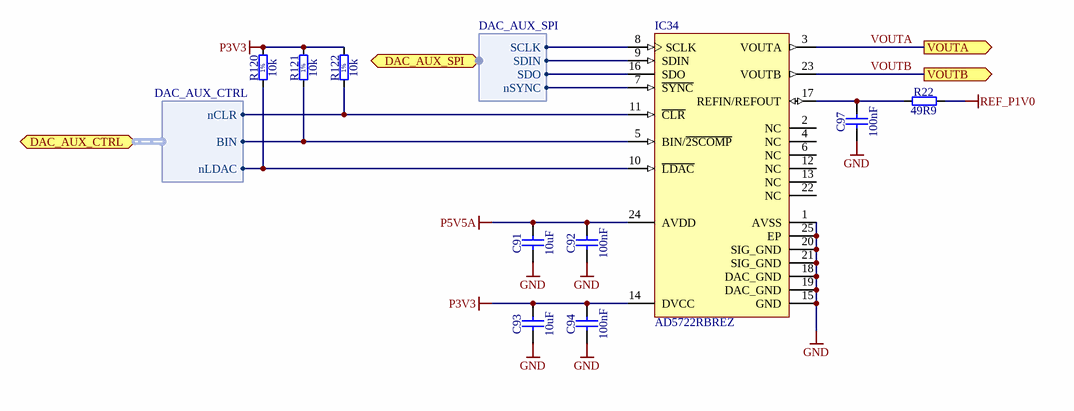
[diagram p13: DAC_AUX.SchDoc]

### Parts
C91  10uF  [CAPC1608X80N]
C92  100nF  [CAPC1005X55N]
C93  10uF  [CAPC1608X80N]
C94  100nF  [CAPC1005X55N]
C97  100nF  [CAPC1005X55N]
IC34  AD5722RBREZ  [RE-24_N]
R22  49R9  [RESC1005X40N]
R120  10k  [RESC1005X40N]
R121  10k  [RESC1005X40N]
R122  10k  [RESC1005X40N]

### Ports
DAC_AUX_CTRL (bidir, harness DAC_AUX_CTRL), DAC_AUX_SPI (bidir, harness DAC_AUX_SPI), VOUTA (out), VOUTB (out)

### Harnesses
DAC_AUX_SPI: SCLK, SDIN, SDO, nSYNC
DAC_AUX_CTRL: nCLR, BIN, nLDAC

### Nets
GND: C91.1 C92.1 C93.1 C94.1 C97.1 IC34.1(AVSS) IC34.15(GND) IC34.18(DAC_GND) IC34.19(DAC_GND) IC34.20(SIG_GND) IC34.21(SIG_GND) IC34.25(EP)
P3V3: C93.2 C94.2 IC34.14(DVCC) R120.2 R121.2 R122.2
P5V5A: C91.2 C92.2 IC34.24(AVDD)
REF_P1V0: R22.2
DAC_AUX_BIN: IC34.5(BIN/~{2SCOMP}) R121.1 ; port DAC_AUX_CTRL.BIN
DAC_AUX_nCLR: IC34.11(~{CLR}) R122.1 ; port DAC_AUX_CTRL.nCLR
DAC_AUX_nLDAC: IC34.10(~{LDAC}) R120.1 ; port DAC_AUX_CTRL.nLDAC
DAC_AUX_nSYNC: IC34.7(~{SYNC}) ; port DAC_AUX_SPI.nSYNC
DAC_AUX_SCLK: IC34.8(SCLK) ; port DAC_AUX_SPI.SCLK
DAC_AUX_SDIN: IC34.9(SDIN) ; port DAC_AUX_SPI.SDIN
DAC_AUX_SDO: IC34.16(SDO) ; port DAC_AUX_SPI.SDO
VOUTA: IC34.3(VOUTA) ; port VOUTA
VOUTB: IC34.23(VOUTB) ; port VOUTB
NetC97_2: C97.2 IC34.17(REFIN/REFOUT) R22.1

Not connected (* = marked no-connect by the designer): IC34 2(NC) 4(NC) 6(NC) 12(NC) 13(NC) 22(NC)

### Notes on the sheet
- Project/Equipment
- Document
- Designer
- Drawn by
- Check.by
- Copyright WUT ISE 2020.
  This documentation describes Open Hardware and is licensed under the CERN OHL v.1.2. You may redistribute and modify this documentation under the terms of the CERN OHL v.1.2. (http://ohwr.org/CERNOHL). This documentation is distributed WITHOUT ANY EXPRESS OR IMPLIED WARRANTY, INCLUDING OF MERCHANTABILITY, SATISFACTORY QUALITY AND FITNESS FOR A PARTICULAR PURPOSE. Please see the CERN OHL v.1.2 for applicable conditions.
- Contact
- File
- Last Mod.
- Print Date
- Sheet
- Size
- A3
- of
- Rev
- (in symbol R0402_10K_1%_0.0625W_100PPM) 1%

### Library data of the parts
C91 C93 = CC0603_10UF_10V_10%_X5R: Non-polarised capacitor; Part Description: SMD Multilayer Chip Ceramic Capacitor; Manufacturer: GENERIC; Manufacturer1 Part Number: GRM188R61A106KE69D; Voltage: 10V; TC: X5R; Tolerance: ±10%; Part Number: CC0603_10UF_10V_10%_X5R; Component Kind: Standard; Component Type: Standard; Pin Count: 2; Value: 10uF; Status: None; Manufacturer Part Number: CC0603_10UF_10V_10%_X5R; Case: 0603; Mounted: Yes; Socket: No; SMD: Yes; Sense: No; Manufacturer1 Example: MURATA; Manufacturer1 ComponentHeight: 0.8mm; HelpURL: \\cern.ch\dfs\Applications\Altium\Datasheets\CC0603_MURATA_GRM188R61A106KE69D.pdf; Author: CERN DEM JLC; CreateDate: 31-Jan-17; LatestRevisionDate: 31-Jan-17
C92 C94 C97 = CC0402_100NF_16V_10%_X7R: as C56 on sheet DAC_AFE; Part Number: CC0402_100NF_16V_10%_X7R; Component Kind: Standard; Component Type: Standard; Pin Count: 2; Value: 100nF; Status: Not Recommended; Manufacturer Part Number: CC0402_100NF_16V_10%_X7R; Case: 0402; Mounted: Yes; Socket: No; SMD: Yes; Sense: No; Manufacturer1 Example: MURATA; Manufacturer1 ComponentHeight: 0.55mm; HelpURL: \\cern.ch\dfs\Applications\Altium\Datasheets\CC0402_X7R_MURATA_GRM.pdf; Author: CERN DEM JLC; CreateDate: 05-Dec-13; LatestRevisionDate: 03-Dec-07
IC34 = CMP-0318-01660-2: Dual 12-Bit Voltage Output Digital-to-Analog Converter with Serial Interface, -40 to +85 degC, RE-24, Pb-Free, Tube; Manufacturer: Analog Devices; Single Supply: Yes; Resolution (Bits): 12; Op Pwr Diss: 190mW; Settling Time: 7.5Âµs; # DAC Outputs: 2; Max V+: 16.5V; Packing: Tube; ComponentLink4URL: http://www.analog.com/en/digital-to-analog-converters/da-converters/ad5722r/products/product.html; ComponentLink1Description: Manufacturer URL; ComponentLink2Description: Datasheet; ComponentLink4Description: Product URL; ComponentLink3Description: Package Specification; PartNumber: AD5722RBREZ; Code_JEDEC: MO-153-ADT; RevisionNote: Component URL fixed; ComponentLink2URL: http://www.analog.com/static/imported-files/data_sheets/AD5722R_5732R_5752R.pdf; ComponentLink5URL: http://www.analog.com/en/digital-to-analog-converters/da-converters/ad5722r/products/product.html#prod_cross_sell; ComponentLink1URL: http://www.analog.com/en/index.html; PackageVersion: 050806-A; RoHS: Y; DatasheetVersion: Rev.D; Generic Part Number: AD5722R; PackageDescription: 24-Lead Thin Shrink Small Outline Package, Exposed Pad [TSSOP_EP]; ComponentLink5Description: Reference Design URL; Mounting Technology: Surface Mount; ComponentLink3URL: http://www.analog.com/static/imported-files/packages/PKG_PDF/TSSOP_EP(RE)/RE_24.pdf; PackageReference: RE-24
R22 = R0402_49R9_1%_0.0625W_100PPM: Resistor - 1%; Part Description: General Purpose Thick Film Chip Resistor; Manufacturer: GENERIC; Manufacturer1 Part Number: 232270674999L or RC0402FR-0749R9L; TC: ±100ppm/°C; PressFit: No; Part Number: R0402_49R9_1%_0.0625W_100PPM; Component Kind: Standard; Component Type: Standard; Pin Count: 2; Value: 49R9; Status: Not Recommended; Power: 0.0625W; Tolerance: ±1%; Manufacturer Part Number: R0402_49R9_1%_0.0625W_100PPM; Case: 0402; Mounted: Yes; Sense: No; Socket: No; SMD: Yes; Manufacturer1 Example: YAGEO PHYCOMP; Manufacturer1 ComponentHeight: 0.4mm; HelpURL: \\cern.ch\dfs\Applications\Altium\Datasheets\R0402_Phycomp_RC0402.pdf; Author: CERN DEM JLC; CreateDate: 24.10.2012; LatestRevisionDate: 24.10.2012
R120-R122 = R0402_10K_1%_0.0625W_100PPM: as R68 on sheet DAC_AFE; Part Number: R0402_10K_1%_0.0625W_100PPM; Component Kind: Standard; Component Type: Standard; Pin Count: 2; Value: 10k; Status: Not Recommended; Manufacturer Part Number: R0402_10K_1%_0.0625W_100PPM; Case: 0402; Mounted: Yes; Sense: No; Socket: No; SMD: Yes; Manufacturer1 Example: YAGEO PHYCOMP; Manufacturer1 ComponentHeight: 0.4mm; HelpURL: \\cern.ch\dfs\Applications\Altium\Datasheets\R0402_Phycomp_RC0402.pdf; Author: CERN DEM JLC; CreateDate: 03-Dec-07; LatestRevisionDate: 17-Oct-12; Power: 0.0625W; Tolerance: ±1%